# EAGLE design ArduinoRadioV3 (EAGLE 9.5.2)
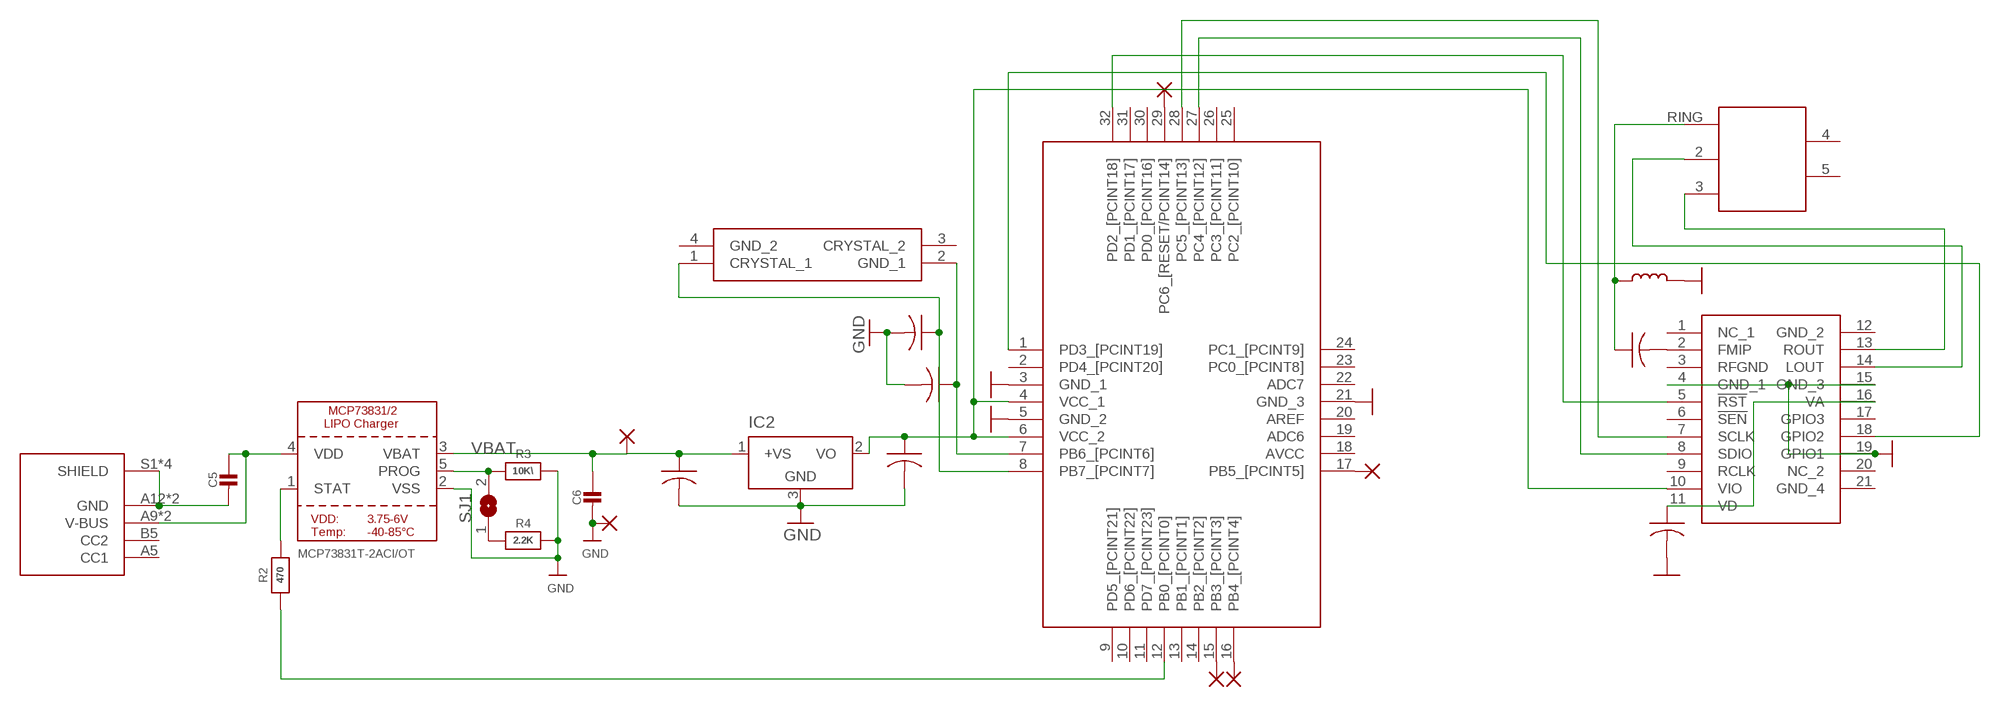
[diagram p0: schematic, sheet 1]

## Parts
C1  10pF  C-USC0402  [C0402]
C2  10pF  C-USC0402  [C0402]
C3  47uf  C-USC1206  [C1206]
C4  47uF  C-USC1206  [C1206]
C5  10µF  CAP_CERAMIC0805-NOOUTLINE  [0805-NO@1]
C6  10µF  CAP_CERAMIC0805-NOOUTLINE  [0805-NO@1]
C7  22nF  C-USC0603  [C0603]
C8  100pF  C-USC1206  [C1206]
IC1  ATMEGA328P-AU  [QFP80P900X900X120-32N]
IC2  LM50  [SOT23]
IC3  SI4703-C19-GM  [SI4703C19GM]
J1  UJC-HP-3-SMT-TR  [CUI_UJC-HP-3-SMT-TR]
L1  L_0603  [L0603]
PAD1  WIREPADSMD1,27-254  [SMD1,27-2,54]
PAD2  WIREPADSMD1,27-254  [SMD1,27-2,54]
PAD3  SMD2  [SMD1,27-2,54]
PAD4  SMD2  [SMD1,27-2,54]
PAD5  SMD2  [SMD1,27-2,54]
PAD6  SMD2  [SMD1,27-2,54]
R2  470  RESISTOR_0603_NOOUT  [0603-NO]
R3  10K\  RESISTOR_0603_NOOUT  [0603-NO]
R4  2.2K  RESISTOR_0603_NOOUT  [0603-NO]
SJ1  SOLDERJUMPER  [SOLDERJUMPER_ARROW_NOPASTE]
U1  MCP73831T-2ACI/OT  MCP73831/2  [SOT23-5]
U$1  STX-3542-5N-G-TR  [STX-3542-5N-G-TR]
Y1  ABM3B-8.000MHZ-10-1-U-T  [ABM3B]

## Nets
3V3: C4.1 IC1.4(VCC_1) IC1.6(VCC_2) IC2.2(VO) IC3.10(VIO)
5V: C5.1 J1.A9(V-BUS) J1.B9(V-BUS) U1.4(VDD)
ANT: C8.1 L1.2 U$1.RING
GND: C1.2 C2.2 C3.2 C4.2 C5.2 C6.2 C7.2 IC1.3(GND_1) IC1.5(GND_2) IC1.21(GND_3) IC2.3(GND) IC3.4(GND_1) IC3.15(GND_3) IC3.19(GPIO1) J1.A12(GND) J1.B12(GND) J1.S1(SHIELD) J1.S2(SHIELD) J1.S3(SHIELD) J1.S4(SHIELD) L1.1 PAD2.1(P) R3.2 R4.2 U1.2(VSS)
GPIO2: IC1.1(PD3_[PCINT19]) IC3.18(GPIO2)
LOUT: IC3.14(LOUT) U$1.2
MISO: IC1.16(PB4_[PCINT4]) PAD5.1(P)
MOSI: IC1.15(PB3_[PCINT3]) PAD6.1(P)
N$3: R4.1 SJ1.1
N$4: C8.2 IC3.2(FMIP)
PROG: R3.1 SJ1.2 U1.5(PROG)
RESET: IC1.29(PC6_[RESET/PCINT14]) PAD3.1(P)
ROUT: IC3.13(ROUT) U$1.3
RST: IC1.32(PD2_[PCINT18]) IC3.5(!RST)
SCK: IC1.17(PB5_[PCINT5]) PAD4.1(P)
SCLK: IC1.28(PC5_[PCINT13]) IC3.7(SCLK)
SDIO: IC1.27(PC4_[PCINT12]) IC3.8(SDIO)
STAT: IC1.12(PB0_[PCINT0]) R2.1 R2.2 U1.1(STAT)
VBAT: C3.1 C6.1 C7.1 IC2.1(+VS) IC3.11(VD) IC3.16(VA) PAD1.1(P) U1.3(VBAT)
XTAL1: C1.1 IC1.7(PB6_[PCINT6]) Y1.2(GND_1)
XTAL2: C2.1 IC1.8(PB7_[PCINT7]) Y1.1(CRYSTAL_1)
Unconnected: IC1.2(PD4_[PCINT20]) IC1.9(PD5_[PCINT21]) IC1.10(PD6_[PCINT22]) IC1.11(PD7_[PCINT23]) IC1.13(PB1_[PCINT1]) IC1.14(PB2_[PCINT2]) IC1.19(ADC6) IC1.20(AREF) IC1.22(ADC7) IC1.23(PC0_[PCINT8]) IC1.24(PC1_[PCINT9]) IC1.25(PC2_[PCINT10]) IC1.26(PC3_[PCINT11]) IC1.30(PD0_[PCINT16]) IC1.31(PD1_[PCINT17]) IC3.1(NC_1) IC3.3(RFGND) IC3.6(!SEN) IC3.9(RCLK) IC3.12(GND_2) IC3.17(GPIO3) IC3.20(NC_2) IC3.21(GND_4) J1.A5(CC1) J1.B5(CC2) U$1.4 U$1.5 Y1.3(CRYSTAL_2) Y1.4(GND_2)

## Power pins joined to a net without a drawn wire
AVCC: IC1.18(AVCC)

## Library data of the parts
C1 C2 = rcl:C-US: CAPACITOR, American symbol; SPICEPREFIX: C
C3 C4 = better14pin:C-US: CAPACITOR, American symbol
C5 C6 = microbuilder:CAP_CERAMIC: Ceramic Capacitors For new designs, use the packages preceded by an '_' character since they are more reliable: The following footprints should be used on most boards: _0402 - Standard footprint for regular board layouts _0603 - Standard footprint for regular board layouts _0805 - Standard footprint for regular board layouts _1206 - Standard footprint for regular board layouts For extremely tight-pitch boards where space is at a premium, the following 'micro-pitch' footprints can be used (smaller pads, no silkscreen outline, etc.): _0402MP - Micro-pitch footprint for very dense/compact boards _0603MP - Micro-pitch footprint for very dense/compact boards _0805MP - Micro-pitch footprint for very dense/compact boards _1206MP - Micro-pitch footprint for very dense/compact boards
C7 C8 = adafruit:C-US: CAPACITOR, American symbol
IC1 = SamacSys_Parts:ATMEGA328P-AU: MICROCHIP - ATMEGA328P-AU. - MICROCONTROLLER MCU, 8 BIT, ATMEGA, 20MHZ, TQFP-32 Source: Datasheet <https://componentsearchengine.com/Datasheets/2/ATMEGA328P-AU.pdf>; DESCRIPTION: MICROCHIP - ATMEGA328P-AU. - MICROCONTROLLER MCU, 8 BIT, ATMEGA, 20MHZ, TQFP-32; HEIGHT: 1.2mm; MANUFACTURER_NAME: Microchip; MANUFACTURER_PART_NUMBER: ATMEGA328P-AU; MOUSER_PART_NUMBER: 556-ATMEGA328P-AU; MOUSER_PRICE-STOCK: https://www.mouser.co.uk/ProductDetail/Microchip-Technology-Atmel/ATMEGA328P-AU?qs=K8BHR703ZXiCmmgp6%2FGNmQ%3D%3D
IC2 = linear:LM50: SOT-23 Single-Supply Centigrade Temperature Sensor Vout = (10mV/°C x Temp °C) +5mmmV Source: http://cache.national.com/ds/LM/LM50.pdf
IC3 = SamacSys_Parts:SI4703-C19-GM: SILICON LABS - SI4703-C19-GM - RF RECEIVER, 108MHZ, -20 TO 85DEG C Source: Datasheet; DESCRIPTION: SILICON LABS - SI4703-C19-GM - RF RECEIVER, 108MHZ, -20 TO 85DEG C; HEIGHT: 0.55mm; MANUFACTURER_NAME: Silicon Labs; MANUFACTURER_PART_NUMBER: Si4703-C19-GM; MOUSER_PART_NUMBER: 634-SI4703-C19-GM; MOUSER_PRICE-STOCK: https://www.mouser.co.uk/ProductDetail/Silicon-Labs/SI4703-C19-GM?qs=JiL6vA75y8O1ZAxL45qs%252BQ%3D%3D
J1 = UJC-HP-3-SMT-TR:UJC-HP-3-SMT-TR: USB RECEPTACLE; AVAILABILITY: Unavailable; CUI_PURCHASE_URL: https://www.cuidevices.com/product/interconnect/connectors/usb-connectors/ujc-hp-3-smt-tr?utm_source=snapeda.com&utm_medium=referral&utm_campaign=snapedaBOM; DESCRIPTION: Type C, 3 A, Right Angle, Surface Mount (SMT), Power Only USB Receptacle; DIGIKEY-PURCHASE-URL: https://snapeda.com/shop?store=DigiKey&id=4722774; MF: CUI Devices; MP: UJC-HP-3-SMT-TR; PACKAGE: Package; PRICE: None
L1 = rc-master-smd:L_: INDUCTOR
PAD1 PAD2 = wirepad:WIREPAD: Wire PAD connect wire on PCB
PAD3-PAD6 = wirepad:SMD2: SMD PAD
R2-R4 = microbuilder:RESISTOR: Resistors For new designs, use the packages preceded by an '_' character since they are more reliable: The following footprints should be used on most boards: _0402 - Standard footprint for regular board layouts _0603 - Standard footprint for regular board layouts _0805 - Standard footprint for regular board layouts _1206 - Standard footprint for regular board layouts For extremely tight-pitch boards where space is at a premium, the following 'micro-pitch' footprints can be used (smaller pads, no silkscreen outline, etc.): _0402MP - Micro-pitch footprint for very dense/compact boards _0603MP - Micro-pitch footprint for very dense/compact boards _0805MP - Micro-pitch footprint for very dense/compact boards _1206MP - Micro-pitch footprint for very dense/compact boards
SJ1 = microbuilder:SOLDERJUMPER: SMD Solder JUMPER Solder the two pads together to create a connection, or remove the solder to break it. REFLOW - Use this footprint for solder paste and reflow ovens. WAVE - Use this footprint for hand-soldering (larger pads). CLOSED - Has a trace between the two pads to ensure it is closed by default. The trace needs to be cut to disable the jumper, and can be closed again by creating a solder bridge between the two pads.; BOM: EXCLUDE
U1 = microbuilder:MCP73831/2: MCP73831/2 LIPO Charger VDD: 3.75 - 6V Temp -40 - 85°C Programmable Charge Rate: 15-500mA NOTE: STAT is a tri-state logic output on the MCP73831 and an open-drain output on the MCP73832. SOT23-5 with 4.2V output and tri-state logic on STAT = MCP73831T-2ACI/OT
U$1 = STX-3542-5N-G-TR:STX-3542-5N-G-TR
Y1 = SamacSys_Parts:ABM3B-8.000MHZ-10-1-U-T: Abracon 8MHz Crystal +/-10ppm 4-SMD, No Lead 5 x 3 x 1.1mm Source: Datasheet <https://abracon.com/Resonators/abm3b.pdf>; DESCRIPTION: Abracon 8MHz Crystal +/-10ppm 4-SMD, No Lead 5 x 3 x 1.1mm; HEIGHT: mm; MANUFACTURER_NAME: ABRACON; MANUFACTURER_PART_NUMBER: ABM3B-8.000MHZ-10-1-U-T; MOUSER_PART_NUMBER: 815-ABM3B8MHZ101UT; MOUSER_PRICE-STOCK: https://www.mouser.co.uk/ProductDetail/ABRACON/ABM3B-8000MHZ-10-1-U-T?qs=axzvp2Rdp5%252B1td01iPkwcw%3D%3D

## Board
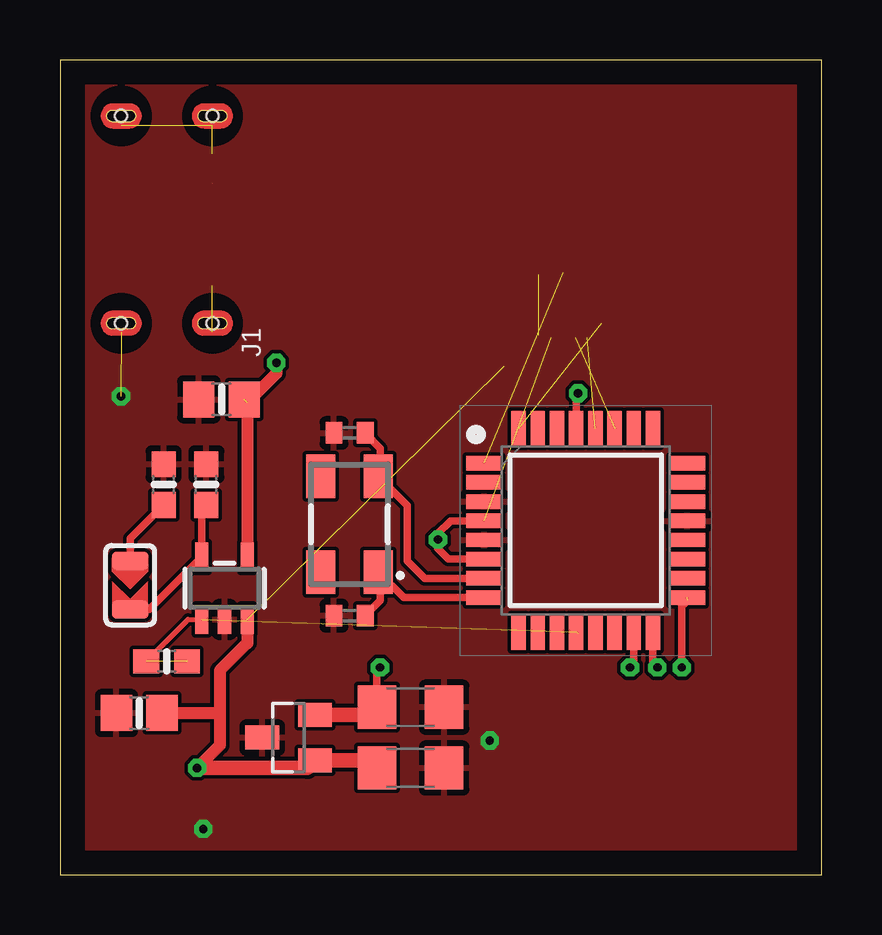
[diagram p1: board, top side]
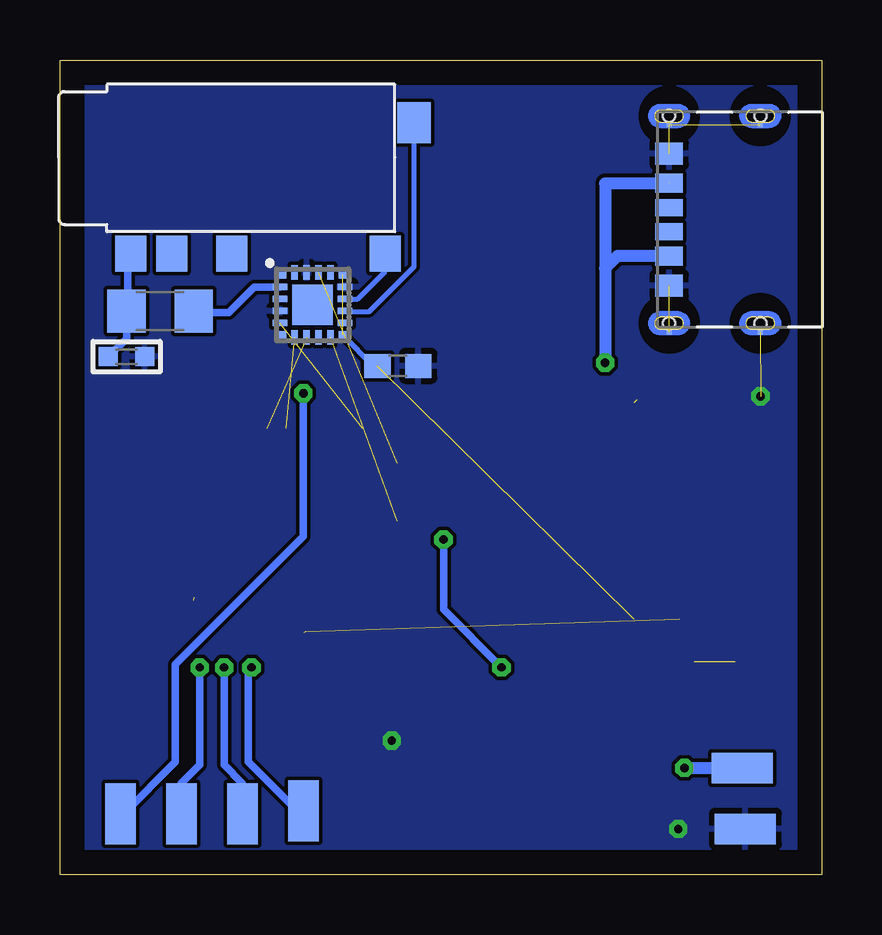
[diagram p2: board, bottom side, seen from below]

Size 31.73 x 33.96 mm. Coordinates in mm from the lower left corner, seen from the top.
Outline: 0,0 31.73,0 31.73,33.96 0,33.96 0,0
Copper layers (1*16): Top 0.035mm / dielectric 1.5mm / Bottom 0.035mm
Design rules "default": minimum track width 6mil, minimum drill 0.35mm, track to track 6mil, track to pad 6mil, pad to pad 6mil, via to via 6mil, smd to smd 6mil, copper to edge 40mil, drill to drill 6mil, minimum pad ring 10mil, minimum via ring 8mil, stop-mask expansion 4mil, vias tented up to drill 0mil, thermal gap 10mil

### Footprints (pad centres in the part's own frame; a part is rotated, then mirrored left to right if it is on the bottom)
C0402 = smd 0.7 x 0.9: 1 -0.65,0; 2 0.65,0
C1206 = smd 1.6 x 1.8: 1 -1.4,0; 2 1.4,0
0805-NO@1 = smd 1.3 x 1.5: 1 -0.95,0; 2 0.95,0
C0603 = smd 1.1 x 1: 1 -0.85,0; 2 0.85,0
QFP80P900X900X120-32N = smd 1.475 x 0.6: 1 -4.238,2.8; 2 -4.238,2; 3 -4.238,1.2; 4 -4.238,0.4; 5 -4.238,-0.4; 6 -4.238,-1.2; 7 -4.238,-2; 8 -4.238,-2.8; 17 4.238,-2.8; 18 4.238,-2; 19 4.238,-1.2; 20 4.238,-0.4; 21 4.238,0.4; 22 4.238,1.2; 23 4.238,2; 24 4.238,2.8 | smd 0.6 x 1.475: 9 -2.8,-4.238; 10 -2,-4.238; 11 -1.2,-4.238; 12 -0.4,-4.238; 13 0.4,-4.238; 14 1.2,-4.238; 15 2,-4.238; 16 2.8,-4.238; 25 2.8,4.238; 26 2,4.238; 27 1.2,4.238; 28 0.4,4.238; 29 -0.4,4.238; 30 -1.2,4.238; 31 -2,4.238; 32 -2.8,4.238
SOT23 = smd 1 x 1.4: 1 -0.95,-1.1; 2 0.95,-1.1; 3 0,1.1
SI4703C19GM = smd 0.34 x 0.34: 1 -1.265,1.265; 6 -1.265,-1.265; 11 1.265,-1.265; 16 1.265,1.265 | smd 0.61 x 0.28: 2 -1.355,0.75; 3 -1.355,0.25; 4 -1.355,-0.25; 5 -1.355,-0.75; 12 1.355,-0.75; 13 1.355,-0.25; 14 1.355,0.25; 15 1.355,0.75 | smd 0.28 x 0.61: 7 -0.75,-1.355; 8 -0.25,-1.355; 9 0.25,-1.355; 10 0.75,-1.355; 17 0.75,1.355; 18 0.25,1.355; 19 -0.25,1.355; 20 -0.75,1.355 | smd 1.7 x 1.7: 21 0,0
CUI_UJC-HP-3-SMT-TR = smd 0.7 x 1.15: A5 -0.5,0; B5 0.5,0 | smd 0.8 x 1.15: A9 1.52,0; B9 -1.52,0 | smd 0.9 x 1.15: A12 2.75,0; B12 -2.75,0 | smd 0.2 x 0.2: S1 -4.695,0; S2 3.945,0; S3 -4.695,-3.8; S4 3.945,-3.8 | hole 0.5: -4.32,0; 4.32,0; -4.32,-3.8; 4.32,-3.8
L0603 = smd 0.8 x 0.8: 1 -0.762,0; 2 0.762,0
SMD1,27-2,54 = smd 1.27 x 2.54: 1 0,0
0603-NO = smd 1.075 x 1: 1 -0.85,0; 2 0.85,0
SOLDERJUMPER_ARROW_NOPASTE = smd 0.762 x 1.524: 1 -1.016,0; 2 1.016,0
SOT23-5 = smd 0.55 x 1.2: 1 -0.95,-1.3; 2 0,-1.3; 3 0.95,-1.3; 4 0.95,1.3; 5 -0.95,1.3
STX-3542-5N-G-TR = smd 1.5 x 1.3: 2 -0.9,0.4; 4 -0.9,6.8; 5 -0.9,9.3; RING -0.9,11 | smd 1.7 x 1.4: 3 4.55,-0.8
ABM3B = smd 1.8 x 1.2: 1 -2,-1.2; 2 2,-1.2; 3 2,1.2; 4 -2,1.2

### Placement (x,y rotation side)
C1  12.06,18.41 180 top
C2  12.06,10.79 180 top
C3  14.61,4.45 0 top
C4  14.61,6.99 0 top
C5  6.73,19.81 180 top
C6  3.3,6.73 180 top
C7  17.65,21.21 0 bottom
C8  27.56,23.5 0 bottom
IC1  21.91,14.35 0 top
IC2  9.53,5.71 90 top
IC3  21.21,23.75 0 bottom
J1  6.35,27.3 90 bottom
L1  28.96,21.59 180 bottom
PAD1  3.3,4.45 90 bottom
PAD2  3.17,1.91 90 bottom
PAD3  29.21,2.54 0 bottom
PAD4  26.67,2.54 0 bottom
PAD5  24.13,2.54 0 bottom
PAD6  21.59,2.67 0 bottom
R2  4.45,8.89 0 top
R3  6.1,16.26 90 top
R4  4.32,16.26 90 top
SJ1  2.92,12.06 270 top
U1  6.86,11.94 0 top
U$1  17.78,26.8 90 bottom
Y1  12.06,14.61 90 top

### Tracks (layer width: path | path; a pad name or v marks a point on that pad's centre or on a via)
3V3  (via drill 0.35)  (1 unrouted)
  Top 0.305: IC1.6 16.19,13.15 15.75,13.59 v15.75,13.97 15.75,14.22 16.27,14.75 IC1.4 | C4.1 13.21,8.51 v13.34,8.64
  Top 0.61: C4.1 12.88,6.67 IC2.2
  Bottom 0.305: v13.34,8.64 15.75,11.05 v15.75,13.97
5V  (via drill 0.35)  (2 unrouted)
  Top 0.508: C5.1 7.93,19.81 9.02,20.89 v9.02,21.34 | 7.81,19.68 U1.4
  Bottom 0.152: J1.B9
  Bottom 0.508: J1.A9 9.02,28.82 9.02,25.27 | 9.02,25.27 8.5,25.79 J1.B9 | 9.02,25.27 v9.02,21.34
ANT
  Bottom 0.203: C8.1 28.91,23.55
  Bottom 0.305: C8.1 28.96,22.35 L1.2 | U$1.RING 28.91,25.77 28.91,23.55
GND  (via drill 0.35)  (4 unrouted)
  other vias: 5.97,1.91 17.91,5.59 2.54,19.94
  pour Top: 0,33.97 31.75,33.97 31.75,0 0,0
  pour Bottom: 0,33.91 31.75,33.91 31.75,0 0,0
GPIO2  (1 unrouted)
LOUT
  Bottom 0.203: U$1.2 18.18,25.15 19.33,24 IC3.14
MISO  (via drill 0.35)
  Top 0.305: IC1.16 24.71,8.82 v24.89,8.64
  Bottom 0.305: v24.89,8.64 24.89,4.57 24.13,3.81 PAD5.1
MOSI  (via drill 0.35)
  Top 0.305: IC1.15 23.91,8.79 v23.75,8.64
  Bottom 0.305: v23.75,8.64 23.88,8.51 23.88,4.7 21.84,2.67 PAD6.1
N$3
  Top 0.305: SJ1.1 2.92,14.01 R4.1
N$4
  Bottom 0.203: 26.09,23.43 C8.2
  Bottom 0.305: IC3.2 23.63,24.5 24.7,23.43 26.09,23.43
PROG
  Top 0.305: R3.1 5.91,15.22 U1.5 3.72,11.05 SJ1.2
RESET  (via drill 0.35)
  Top 0.305: IC1.29 21.51,19.98 v21.59,20.07
  Bottom 0.305: v21.59,20.07 21.59,14.1 26.92,8.76 26.92,4.7 29.08,2.54 PAD3.1
ROUT
  Bottom 0.203: U$1.3 16.98,25.34 18.84,23.48 19.83,23.48 IC3.13
RST  (1 unrouted)
SCK  (via drill 0.35)  (1 unrouted)
  Top 0.305: 26.16,11.55 IC1.17 | v25.91,8.64 25.91,11.18 26.16,11.43
  Bottom 0.305: PAD4.1 26.67,3.81 25.91,4.57 v25.91,8.64
SCLK  (1 unrouted)
SDIO  (1 unrouted)
STAT  (3 unrouted)
  Top 0.203: R2.1 5.34,10.64 U1.1
  Top 0.305: 21.58,10.07 21.55,10.03
VBAT  (via drill 0.35)  (2 unrouted)
  Top 0.508: U1.3 7.81,9.65 6.67,8.51 6.67,6.73 | C6.1 6.67,6.73 | v5.71,4.45 6.67,5.39 6.67,6.73
  Top 0.61: C3.1 12.88,4.76 IC2.1 10.3,4.45 v5.71,4.45
  Bottom 0.203: C7.1 18.67,21.21 IC3.11
  Bottom 0.254: C7.1 18.75,20.96
  Bottom 0.508: v5.71,4.45 PAD1.1
XTAL1
  Top 0.305: Y1.2 13.35,16.52 | 13.35,16.52 14.48,15.39 14.48,13.08 15.21,12.35 IC1.7 | C1.1 13.35,17.77 13.35,16.52
XTAL2
  Top 0.305: IC1.8 14.32,11.55 Y1.1 13.34,12.54 13.34,11.43 12.71,10.81 C2.1